# Altium project 17- 0010 ESP32-S3 Control IO.PrjPcb
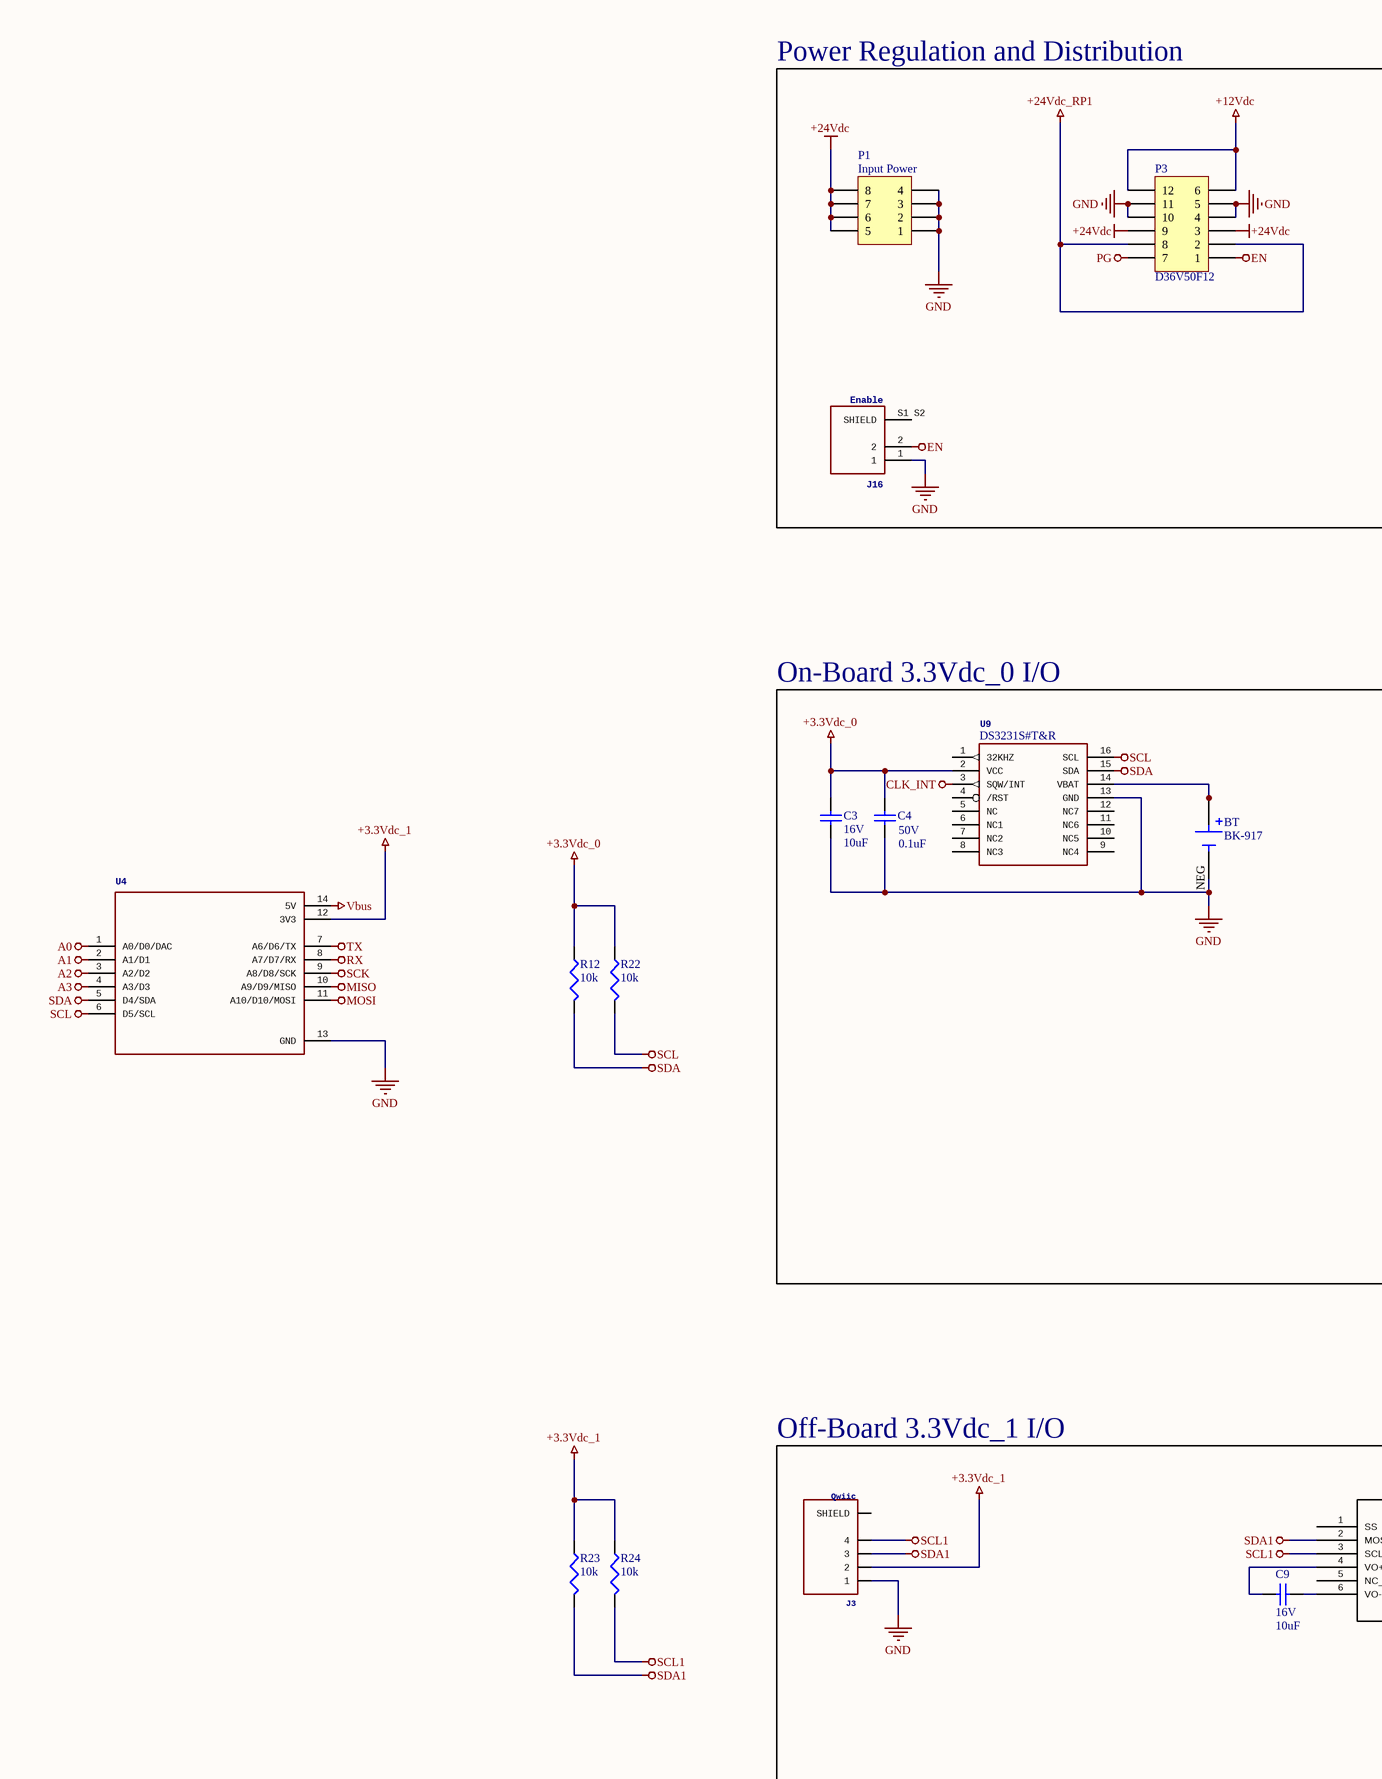
[diagram p0: Sheet1.SchDoc, left]
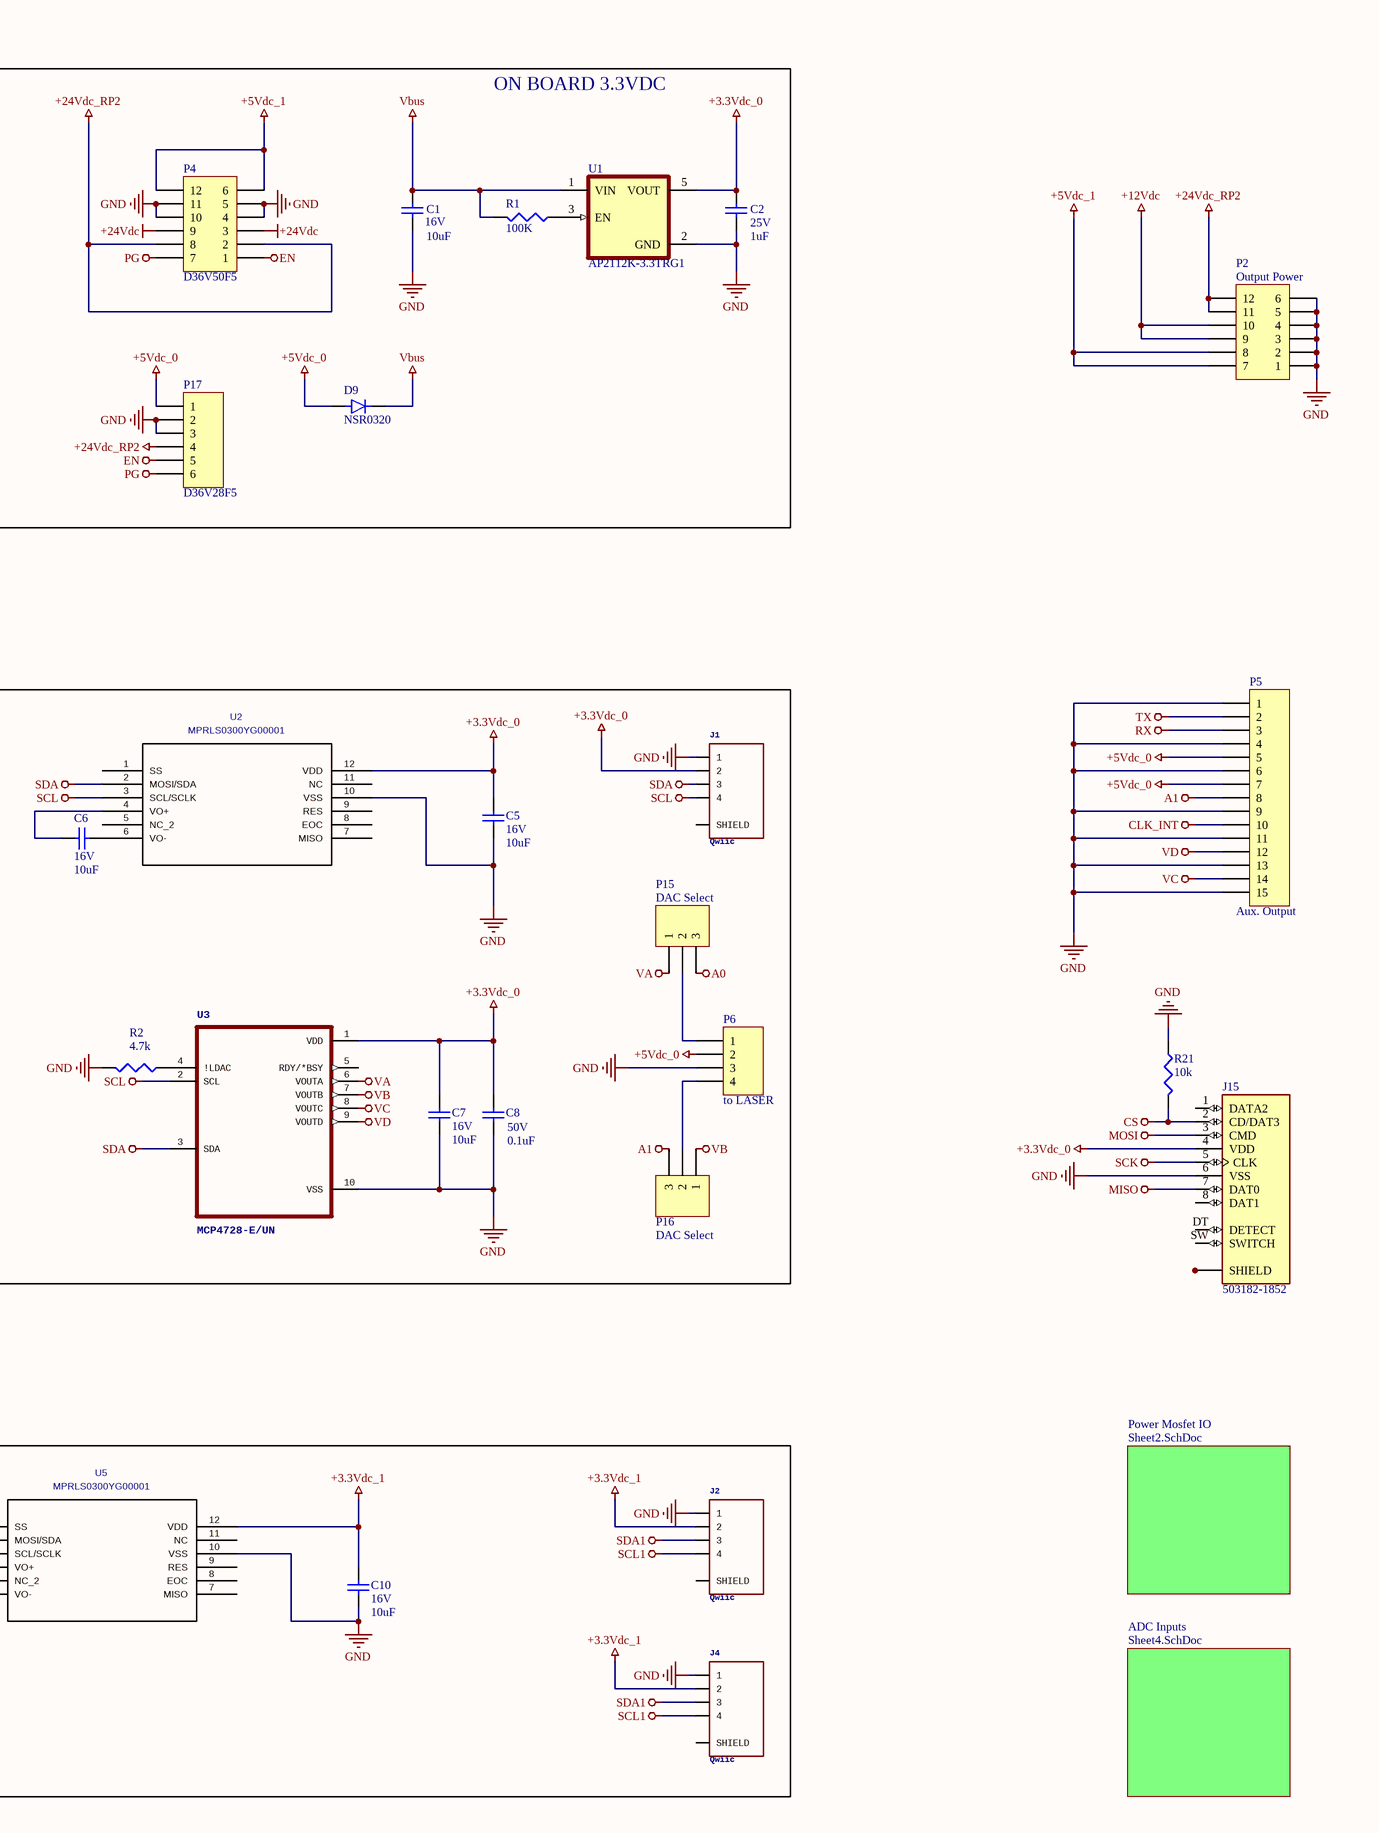
[diagram p1: Sheet1.SchDoc, right]
3 sheets, 100 parts. Net scope: global (net labels, ports and power ports of the same name join across sheets).
Sheets:
  Sheet1.SchDoc
    Power Mosfet IO = Sheet2.SchDoc
    ADC Inputs = Sheet4.SchDoc

## Sheet Sheet1.SchDoc
size A2

### Parts
BT  BK-917  [BAT_BK-917]
C1  16V  value 10uF  [1608[0603]]
C2  25V  value 1uF  [1608[0603]]
C3  16V  value 10uF  [1608[0603]]
C4  50V  value 0.1uF  [1608[0603]]
C5  16V  value 10uF  [1608[0603]]
C6  16V  value 10uF  [1608[0603]]
C7  16V  value 10uF  [1608[0603]]
C8  50V  value 0.1uF  [1608[0603]]
C9  16V  value 10uF  [1608[0603]]
C10  16V  value 10uF  [1608[0603]]
D9  NSR0320  [DIO_MM3Z3V0T1G]
J1  Qwiic  [4P vert]
J2  Qwiic  [4P vert]
J3  Qwiic  [JST_SM04B-SRSS-TB(LF)(SN)]
J4  Qwiic  [JST_SM04B-SRSS-TB(LF)(SN)]
J15  503182-1852  [MOLEX_503182-1852]
J16  Enable  [CONN_BM04B-SRSS-TB(LF)(SN)]
P1  Input Power  [2X4 VERTICAL]
P2  Output Power  [MOLEX_430451214]
P3  D36V50F12  [D36V50FXX, 4.5A]
P4  D36V50F5  [D36V50FXX, 4.5A]
P5  Aux. Output  [15P VERT]
P6  to LASER  [4P Mini-SPOX]
P15  DAC Select  [HDR1X3]
P16  DAC Select  [HDR1X3]
P17  D36V28F5  [D36V28Fx, 3A]
R1  value 100K  [J1-0603]  (hidden comment: Res3)
R2  value 4.7k  [0402]  (hidden comment: Res3)
R12  value 10k  [0402]  (hidden comment: Res3)
R21  value 10k  [0402]  (hidden comment: Res3)
R22  value 10k  [0402]  (hidden comment: Res3)
R23  value 10k  [0402]  (hidden comment: Res3)
R24  value 10k  [0402]  (hidden comment: Res3)
U1  AP2112K-3.3TRG1  [SOT95P285X140-5N]
U2  MPRLS0300YG00001  [MPRLS0300YG00000]
U3  MCP4728-E/UN  [SOP50P490X110-10N]
U4  Check availability  [MODULE_ADAFRUIT_QT_PY]  (value not drawn)
U5  MPRLS0300YG00001  [MPRLS0300YG00000]
U9  DS3231S#T&R  [SO16W]

### Blocks framed on the sheet
Power Regulation and Distribution: C1 C2 D9 J16 P1 P3 P4 P17 R1 U1
On-Board 3.3Vdc_0 I/O: BT C3-C8 J1 P6 P15 P16 R2 U2 U3 U9
Off-Board 3.3Vdc_1 I/O: C9 C10 J2-J4 U5

### Sub-sheets
ADC Inputs = Sheet4.SchDoc: no entries
Power Mosfet IO = Sheet2.SchDoc: no entries

### Nets
+3.3Vdc_0: C2.2 C3.1 C4.1 C5.1 C7.1 C8.1 J1.2 J15.4(VDD) R12.1 R22.1 U1.5(VOUT) U2.12(VDD) U3.1(VDD) U9.2(VCC)
+3.3Vdc_1: C10.1 J2.2 J3.2 J4.2 R23.1 R24.1 U4.12(3V3) U5.12(VDD)
+5Vdc_0: D9.A P5.5 P5.7 P6.2 P17.1
+5Vdc_1: P2.7 P2.8 P4.6 P4.12
+12Vdc: P2.9 P2.10 P3.6 P3.12
+24Vdc: P1.5 P1.6 P1.7 P1.8 P3.3 P3.9 P4.3 P4.9
+24Vdc_RP1: P3.2 P3.8
+24Vdc_RP2: P2.11 P2.12 P4.2 P4.8 P17.4
A0: P15.3 U4.1(A0/D0/DAC)
A1: P5.8 P16.3 U4.2(A1/D1)
A2: U4.3(A2/D2)
A3: U4.4(A3/D3)
CLK_INT: P5.10 U9.3(SQW/INT)
CS: J15.2(CD/DAT3) R21.2
EN: J16.2 P3.1 P4.1 P17.5
GND: BT.NEG C1.1 C2.1 C3.2 C4.2 C5.2 C7.2 C8.2 C10.2 J1.1 J2.1 J3.1 J4.1 J15.6(VSS) J16.1 P1.1 P1.2 P1.3 P1.4 P2.1 P2.2 P2.3 P2.4 P2.5 P2.6 P3.4 P3.5 P3.10 P3.11 P4.4 P4.5 P4.10 P4.11 P5.1 P5.4 P5.6 P5.9 P5.11 P5.13 P5.15 P6.3 P17.2 P17.3 R2.2 R21.1 U1.2(GND) U2.10(VSS) U3.10(VSS) U4.13(GND) U5.10(VSS) U9.13(GND)
MISO: J15.7(DAT0) U4.10(A9/D9/MISO)
MOSI: J15.3(CMD) U4.11(A10/D10/MOSI)
PG: P3.7 P4.7 P17.6
RX: P5.3 U4.8(A7/D7/RX)
SCK: J15.5(CLK) U4.9(A8/D8/SCK)
SCL: J1.4 R22.2 U2.3(SCL/SCLK) U3.2(SCL) U4.6(D5/SCL) U9.16(SCL)
SCL1: J2.4 J3.4 J4.4 R24.2 U5.3(SCL/SCLK)
SDA: J1.3 R12.2 U2.2(MOSI/SDA) U3.3(SDA) U4.5(D4/SDA) U9.15(SDA)
SDA1: J2.3 J3.3 J4.3 R23.2 U5.2(MOSI/SDA)
TX: P5.2 U4.7(A6/D6/TX)
VA: P15.1 U3.6(VOUTA)
VB: P16.1 U3.7(VOUTB)
Vbus: C1.2 D9.C(K) R1.2 U1.1(VIN) U4.14(5V)
VC: P5.14 U3.8(VOUTC)
VD: P5.12 U3.9(VOUTD)
NetBT_1+: BT.1+(POS) BT.2+(POS) BT.3+(POS) BT.4+(POS) U9.14(VBAT)
NetC6_1: C6.1 U2.6(VO-)
NetC6_2: C6.2 U2.4(VO+)
NetC9_1: C9.1 U5.4(VO+)
NetC9_2: C9.2 U5.6(VO-)
NetJ15_P1: J15.P1(SHIELD) J15.P2(SHIELD) J15.P3(SHIELD) J15.P4(SHIELD) J15.P5(SHIELD)
NetP6_1: P6.1 P15.2
NetP6_4: P6.4 P16.2
NetR1_1: R1.1 U1.3(EN)
NetR2_1: R2.1 U3.4(!LDAC)

Not connected (* = marked no-connect by the designer): J1 S1 S2(SHIELD); J2 S1 S2(SHIELD); J3 S1 S2(SHIELD); J4 S1 S2(SHIELD); J15 1(DATA2) 8(DAT1) DT(DETECT) SW(SWITCH); J16 S1 S2(SHIELD); U2 1(SS) 5(NC_2) 7(MISO) 8(EOC) 9(RES) 11(NC); U3 5(RDY/*BSY); U5 1(SS) 5(NC_2) 7(MISO) 8(EOC) 9(RES) 11(NC); U9 1(32KHZ) 4(/RST) 5(NC) 6(NC1) 7(NC2) 8(NC3) 9(NC4) 10(NC5) 11(NC6) 12(NC7)

### Notes on the sheet
- ON BOARD 3.3VDC
- Title
- Size:
- Date:
- File:
- A2
- Number:
- Time:
- Revision:
- Sheet
- of

### Library data of the parts
BT = BK-917: BATTERY RETAINER COIN PC PIN; Manufacturer: MPD; Manufacturer Part #: BK-917
C1 C3 C5-C7 C9 C10 = Cap Semi: CAP CER 10UF 16V X5R 0603; Manufacturer Part #: CC0603KRX5R7BB106; Manufacturer: YAGEO; Footprints: 0603
C2 = Cap Semi: CAP CER 1UF 25V X7R 0603; Manufacturer Part #: AC0603KRX7R8BB105; Manufacturer: YAGEO; Footprints: 0603
C4 C8 = Cap Semi: CAP CER 0.1UF 50V X7R 0603; Manufacturer Part #: CC0603KPX7R9BB104; Manufacturer: YAGEO; Footprints: 0603
D9 = S1M: DIODE SCHOTTKY 20V 1A SOD323; Manufacturer Part #: NSR0320MW2T1G; Manufacturer: onsemi; Footprint: SOD-323
J1 J2 = SM04B-SRSS-TB(LF)(SN): Manufacturer Part #: BM04B-SRSS-TB(LF)(SN); Manufacturer: JST Sales
J3 J4 = SM04B-SRSS-TB(LF)(SN): Manufacturer: JST Sales; Manufacturer Part #: SM04B-SRSS-TB(LF)(SN)
J15 = 503182-1852: 10 (8 + 2) Position Card Connector Secure Digital - microSDâ„¢ Surface Mount, Right Angle Gold; Manufacturer: Molex; Manufacturer Part #: 5031821852
J16 = BM04B-SRSS-TB(LF)(SN): Manufacturer: JST Sales; Manufacturer Part #: BM04B-SRSS-TB(LF)(SN)
P1 = Header 4X2A: CONN HEADER VERT 8POS 3MM; Manufacturer Part #: 0430450827; Manufacturer: Molex; Do Not Install: *; Vendor: *; Vendor Part Number: *
P2 = Header 6X2A: CONN HEADER VERT 12POS 3MM; Manufacturer Part #: 0430451227; Manufacturer: Molex
P3 = Header 6X2A: DC DC CONVERTER 12V 54W; Vendor Part Number: 2183-4095-ND; Manufacturer: Pololu; Vendor: digikey; Manufacturer Part #: D36V50F12; Do Not Install: *
P4 = Header 6X2A: 12V, 4.5A Step-Down Voltage Regulator5V, 5.5A Step-Down Voltage Regulator; Vendor: Pololu; Manufacturer Part #: D36V50F5; Do Not Install: *; Vendor Part Number: D36V50F5; Manufacturer: Pololu
P5 = Header 15: Header, 15-Pin; Manufacturer Part #: BM15B-SRSS-TB(LF)(SN); Manufacturer: JST Sales America Inc.
P6 = Header 4: Connector Header Through Hole, Right Angle 4 position 0.098" (2.50mm); Manufacturer Part #: 0022057045; Manufacturer: Molex
P15 P16 = Header 3: Header, 3-Pin; Manufacturer Part #: 68000-103HLF; Manufacturer: Amphenol ICC (FCI)
P17 = Header 6: 5V, 3.2A Step-Down Voltage Regulator; Vendor: Pololu; Manufacturer Part #: D36V28F5; Vendor Part Number: D36V28F5; Manufacturer: Pololu
R1 = Res3: RES 100K OHM 1% 1/4W 0603; Manufacturer Part #: SR0603FR-7T100KL; Manufacturer: YAGEO; Footprints: 0603
R2 = Res3: RES 4.7K OHM 1% 1/5W 0402; Manufacturer Part #: SR0402FR-7T4K7L; Manufacturer: YAGEO; Footprints: 0402
R12 R21-R24 = Res3: RES 10 KOHM 1% 1/8W 0402; Manufacturer Part #: AC0402FR-7W10KL; Manufacturer: YAGEO; Footprints: 0402
U1 = AP2112K-3.3TRG1: IC REG LINEAR 3.3V 600MA SOT25; Manufacturer: Diodes Incorporated; Manufacturer Part #: AP2112K-3.3TRG1; Footprint: SOT-25
U2 U5 = MPRLS0300YG00001: Manufacturer: Honeywell; Manufacturer Part #: MPRLS0300YG00001B
U3 = MCP4728-E/UN: Manufacturer: Microchip; Manufacturer Part #: MCP4728-E/UN
U4 = ADAFRUIT_QT_PY: WiFi Dev Board with STEMMA QT - 8 MB Flash / No PSRAM; Manufacturer Part #: QT PY ESP32-S3; Vendor Part Number: 5426; Do Not Install: DNI; Vendor: Adafruit
U9 = DS3231/SO: Real-Time Clock; Manufacturer: Maxim; Manufacturer Part #: DS3231S#T&R

## Sheet Sheet2.SchDoc
size A3
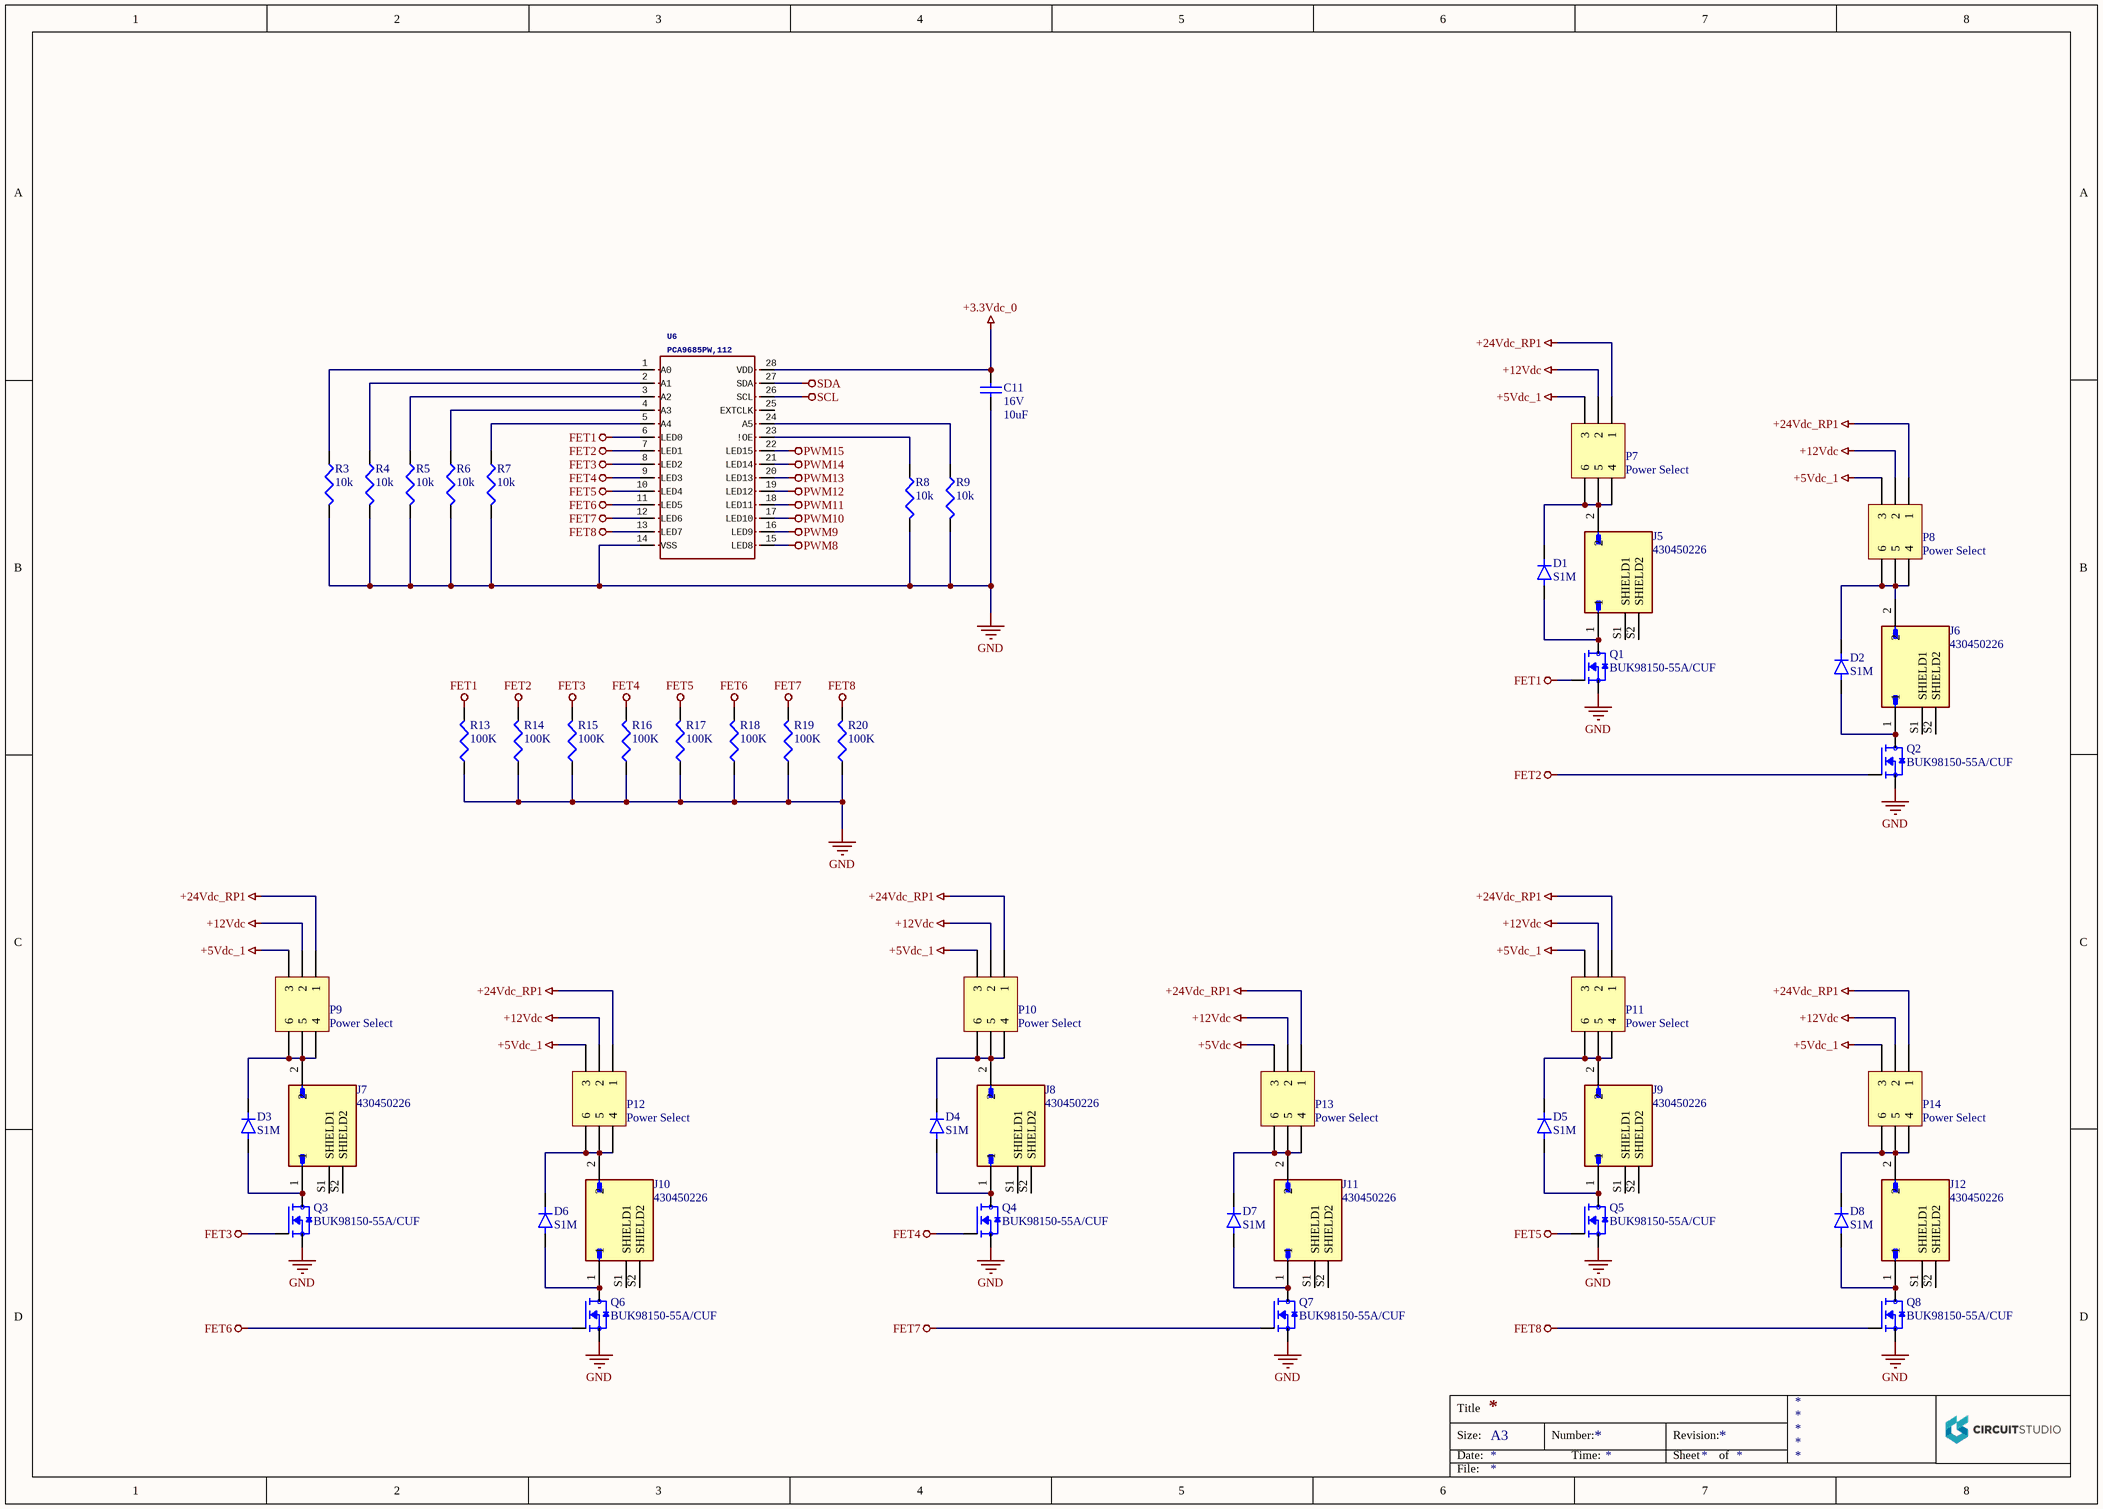
[diagram p2: Sheet2.SchDoc]

### Parts
C11  16V  value 10uF  [1608[0603]]
D1  S1M  [DIOM4325X250N]
D2  S1M  [DIOM4325X250N]
D3  S1M  [DIOM4325X250N]
D4  S1M  [DIOM4325X250N]
D5  S1M  [DIOM4325X250N]
D6  S1M  [DIOM4325X250N]
D7  S1M  [DIOM4325X250N]
D8  S1M  [DIOM4325X250N]
J5  430450226  [MOLEX_430450226]
J6  430450226  [MOLEX_430450226]
J7  430450226  [MOLEX_430450226]
J8  430450226  [MOLEX_430450226]
J9  430450226  [MOLEX_430450226]
J10  430450226  [MOLEX_430450226]
J11  430450226  [MOLEX_430450226]
J12  430450226  [MOLEX_430450226]
P7  Power Select  [HDR2X3_CEN]
P8  Power Select  [HDR2X3_CEN]
P9  Power Select  [HDR2X3_CEN]
P10  Power Select  [HDR2X3_CEN]
P11  Power Select  [HDR2X3_CEN]
P12  Power Select  [HDR2X3_CEN]
P13  Power Select  [HDR2X3_CEN]
P14  Power Select  [HDR2X3_CEN]
Q1  BUK98150-55A/CUF  [SOT230P700X180-4N]
Q2  BUK98150-55A/CUF  [SOT230P700X180-4N]
Q3  BUK98150-55A/CUF  [SOT230P700X180-4N]
Q4  BUK98150-55A/CUF  [SOT230P700X180-4N]
Q5  BUK98150-55A/CUF  [SOT230P700X180-4N]
Q6  BUK98150-55A/CUF  [SOT230P700X180-4N]
Q7  BUK98150-55A/CUF  [SOT230P700X180-4N]
Q8  BUK98150-55A/CUF  [SOT230P700X180-4N]
R3  value 10k  [0402]  (hidden comment: Res3)
R4  value 10k  [0402]  (hidden comment: Res3)
R5  value 10k  [0402]  (hidden comment: Res3)
R6  value 10k  [0402]  (hidden comment: Res3)
R7  value 10k  [0402]  (hidden comment: Res3)
R8  value 10k  [0402]  (hidden comment: Res3)
R9  value 10k  [0402]  (hidden comment: Res3)
R13  value 100K  [J1-0603]  (hidden comment: Res3)
R14  value 100K  [J1-0603]  (hidden comment: Res3)
R15  value 100K  [J1-0603]  (hidden comment: Res3)
R16  value 100K  [J1-0603]  (hidden comment: Res3)
R17  value 100K  [J1-0603]  (hidden comment: Res3)
R18  value 100K  [J1-0603]  (hidden comment: Res3)
R19  value 100K  [J1-0603]  (hidden comment: Res3)
R20  value 100K  [J1-0603]  (hidden comment: Res3)
U6  PCA9685PW,112  [TSSOP28-0.65-9.7X4.4MM]

### Nets
+3.3Vdc_0: C11.1 U6.28(VDD)
+5Vdc: P13.3
+5Vdc_1: P7.3 P8.3 P9.3 P10.3 P11.3 P12.3 P14.3
+12Vdc: P7.2 P8.2 P9.2 P10.2 P11.2 P12.2 P13.2 P14.2
+24Vdc_RP1: P7.1 P8.1 P9.1 P10.1 P11.1 P12.1 P13.1 P14.1
FET1: Q1.1(G) R13.2 U6.6(LED0)
FET2: Q2.1(G) R14.2 U6.7(LED1)
FET3: Q3.1(G) R15.2 U6.8(LED2)
FET4: Q4.1(G) R16.2 U6.9(LED3)
FET5: Q5.1(G) R17.2 U6.10(LED4)
FET6: Q6.1(G) R18.2 U6.11(LED5)
FET7: Q7.1(G) R19.2 U6.12(LED6)
FET8: Q8.1(G) R20.2 U6.13(LED7)
GND: C11.2 Q1.3(S) Q2.3(S) Q3.3(S) Q4.3(S) Q5.3(S) Q6.3(S) Q7.3(S) Q8.3(S) R3.2 R4.2 R5.2 R6.2 R7.2 R8.2 R9.2 R13.1 R14.1 R15.1 R16.1 R17.1 R18.1 R19.1 R20.1 U6.14(VSS)
PWM8: U6.15(LED8)
PWM9: U6.16(LED9)
PWM10: U6.17(LED10)
PWM11: U6.18(LED11)
PWM12: U6.19(LED12)
PWM13: U6.20(LED13)
PWM14: U6.21(LED14)
PWM15: U6.22(LED15)
SCL: U6.26(SCL)
SDA: U6.27(SDA)
NetD1_A: D1.A J5.1 Q1.2(D) Q1.4(D)
NetD1_C: D1.C(K) J5.2 P7.4 P7.5 P7.6
NetD2_A: D2.A J6.1 Q2.2(D) Q2.4(D)
NetD2_C: D2.C(K) J6.2 P8.4 P8.5 P8.6
NetD3_A: D3.A J7.1 Q3.2(D) Q3.4(D)
NetD3_C: D3.C(K) J7.2 P9.4 P9.5 P9.6
NetD4_A: D4.A J8.1 Q4.2(D) Q4.4(D)
NetD4_C: D4.C(K) J8.2 P10.4 P10.5 P10.6
NetD5_A: D5.A J9.1 Q5.2(D) Q5.4(D)
NetD5_C: D5.C(K) J9.2 P11.4 P11.5 P11.6
NetD6_A: D6.A J10.1 Q6.2(D) Q6.4(D)
NetD6_C: D6.C(K) J10.2 P12.4 P12.5 P12.6
NetD7_A: D7.A J11.1 Q7.2(D) Q7.4(D)
NetD7_C: D7.C(K) J11.2 P13.4 P13.5 P13.6
NetD8_A: D8.A J12.1 Q8.2(D) Q8.4(D)
NetD8_C: D8.C(K) J12.2 P14.4 P14.5 P14.6
NetR3_1: R3.1 U6.1(A0)
NetR4_1: R4.1 U6.2(A1)
NetR5_1: R5.1 U6.3(A2)
NetR6_1: R6.1 U6.4(A3)
NetR7_1: R7.1 U6.5(A4)
NetR8_1: R8.1 U6.23(!OE)
NetR9_1: R9.1 U6.24(A5)

Not connected (* = marked no-connect by the designer): J5 S1(SHIELD1) S2(SHIELD2); J6 S1(SHIELD1) S2(SHIELD2); J7 S1(SHIELD1) S2(SHIELD2); J8 S1(SHIELD1) S2(SHIELD2); J9 S1(SHIELD1) S2(SHIELD2); J10 S1(SHIELD1) S2(SHIELD2); J11 S1(SHIELD1) S2(SHIELD2); J12 S1(SHIELD1) S2(SHIELD2); U6 25(EXTCLK)

### Notes on the sheet
- Title
- Size:
- Date:
- A3
- Number:
- Time:
- Revision:
- Sheet
- of
- File:

### Library data of the parts
C11 = Cap Semi: as C1 on sheet Sheet1; Footprints: 0603
D1-D8 = S1M: DIODE GEN PURP 1KV 1A SMA; Manufacturer Part #: S1MLHRVG; Manufacturer: Taiwan Semiconductor
J5-J12 = 430450226: CONN HEADER VERT 2POS; Manufacturer Part #: 0430450226; Manfacturer: Molex; Do Not Install: *; Vendor: *; Vendor Part Number: *
P7-P14 = Header 3X2A: Header, 3-Pin, Dual row; Manufacturer Part #: 67997-206HLF; Manufacturer: Amphenol ICC (FCI)
Q1-Q8 = BUK98150-55A/CUF: N-MOSFET N-CH 55V 5.5A SOT223; Manufacturer: Nexperia USA; Manufacturer Part #: BUK98150-55A/CUF; Footprint: SOT223
R3-R9 = Res3: as R12 on sheet Sheet1; Footprints: 0402
R13-R20 = Res3: as R1 on sheet Sheet1; Footprints: 0603
U6 = DRIVER-PCA9685PW(TSSOP28): Manufacturer: NXP USA; Manufacturer Part #: PCA9685PW,112

## Sheet Sheet4.SchDoc
size A3
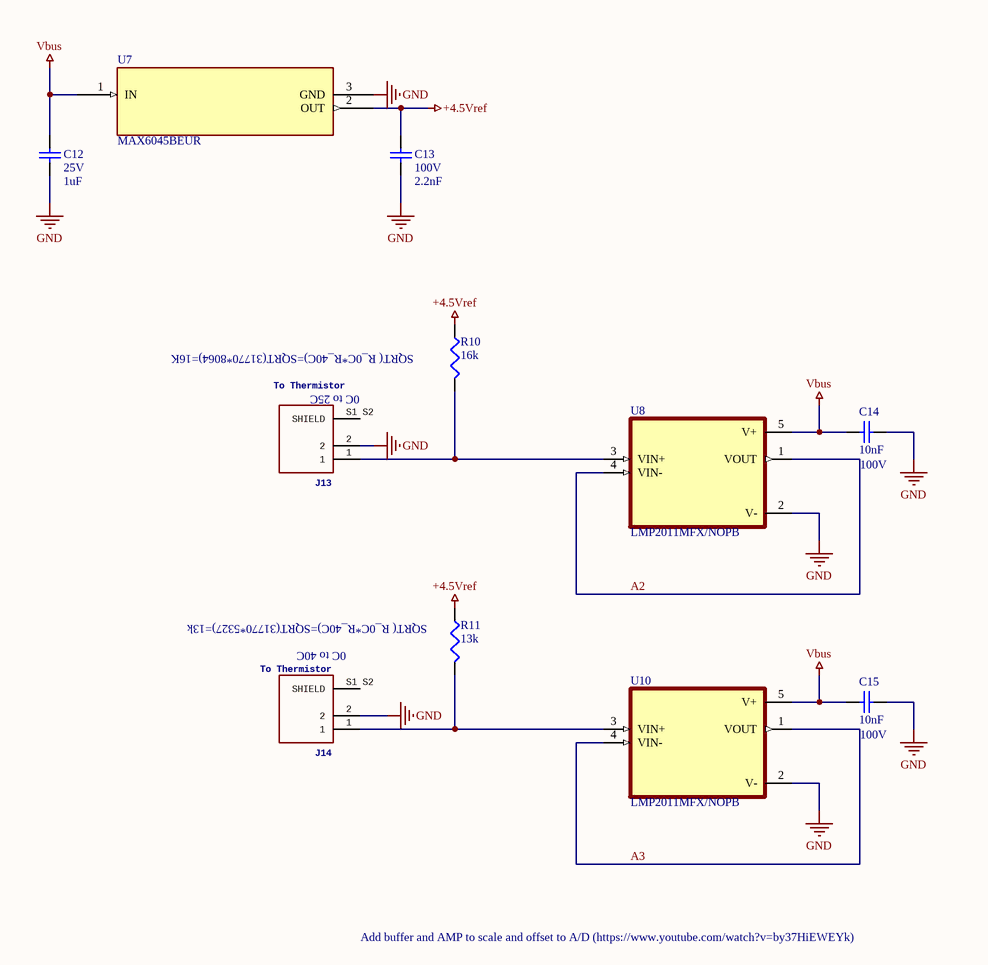
[diagram p3: Sheet4.SchDoc]

### Parts
C12  25V  value 1uF  [1608[0603]]
C13  100V  value 2.2nF  [1608[0603]]
C14  100V  value 10nF  [1608[0603]]
C15  100V  value 10nF  [1608[0603]]
J13  To Thermistor  [CONN_BM04B-SRSS-TB(LF)(SN)]
J14  To Thermistor  [CONN_BM04B-SRSS-TB(LF)(SN)]
R10  value 16k  [J1-0603]  (hidden comment: Res3)
R11  value 13k  [J1-0603]  (hidden comment: SQRT( R_0C*R_40C))
U7  MAX6045BEUR  [21-0051H]
U8  LMP2011MFX/NOPB  [SOT95P280X145-5N]
U10  LMP2011MFX/NOPB

### Nets
+4.5Vref: C13.2 R10.1 R11.1 U7.2(OUT)
A2: U8.1(VOUT) U8.4(VIN-)
A3: U10.1(VOUT) U10.4(VIN-)
GND: C12.1 C13.1 C14.1 C15.1 J13.2 J14.2 U7.3(GND) U8.2(V-) U10.2(V-)
Vbus: C12.2 C14.2 C15.2 U7.1(IN) U8.5(V+) U10.5(V+)
NetJ13_1: J13.1 R10.2 U8.3(VIN+)
NetJ14_1: J14.1 R11.2 U10.3(VIN+)

Not connected (* = marked no-connect by the designer): J13 S1 S2(SHIELD); J14 S1 S2(SHIELD)

### Notes on the sheet
- SQRT( R_0C*R_40C)=SQRT(31770*8064)=16K
- (near J13) 0C to 25C
- (near R11) SQRT( R_0C*R_40C)=SQRT(31770*5327)=13k
- (near J14) 0C to 40C
- Add buffer and AMP to scale and offset to A/D (https://www.youtube.com/watch?v=by37HiEWEYk)
- Title
- Size:
- Date:
- A3
- Number:
- Time:
- Revision:
- Sheet
- of
- File:

### Library data of the parts
C12 = Cap Semi: as C2 on sheet Sheet1; Footprints: 0603
C13 = Cap Semi: CAP CER 2200PF 100V X7R 0603; Manufacturer Part #: CC0603KRX7R0BB222; Manufacturer: YAGEO; Footprints: 0603
C14 C15 = Cap Semi: CAP CER 10000PF 100V X7R 0603; Manufacturer: YAGEO; Manufacturer Part #: CC0603KRX7R0BB103; Footprints: 0603
J13 J14 = BM04B-SRSS-TB(LF)(SN): Manufacturer: JST Sales; Manufacturer Part #: BM04B-SRSS-TB(LF)(SN)
R10 = Res3: Resistor, 0.1%, 1/10W; Manufacturer Part #: ERA-3AEB163V; Manufacturer: Panasonic Electronic Components; Footprints: 0603
R11 = Res3: Resistor, 0.1%, 1/5W; Manufacturer Part #: ERJ-PB3B1302V; Manufacturer: Panasonic Electronic Components; Footprints: 0603
U7 = MAX6045AEUR: Voltage References Precision, Low-Power, Low-Dropout, SOT23-3 Voltage References; Manufacturer: Analog Devices Inc./Maxim Integrated; Manufacturer Part #: MAX6045BEUR
U8 U10 = LMP2011MFX/NOPB: Single, High Precision, Rail-to-Rail Output Operational Amplifier; Manufacturer: Texas Instruments; Manufacturer Part #: LMP2011MFX/NOPB

## Nets that join several sheets
+3.3Vdc_0: Sheet1 (14 pins), Sheet2 (C11.1 U6.28)
+5Vdc_1: Sheet1 (P2.7 P2.8 P4.6 P4.12), Sheet2 (7 pins)
+12Vdc: Sheet1 (P2.9 P2.10 P3.6 P3.12), Sheet2 (8 pins)
+24Vdc_RP1: Sheet1 (P3.2 P3.8), Sheet2 (8 pins)
A2: Sheet1 (U4.3), Sheet4 (U8.1 U8.4)
A3: Sheet1 (U4.4), Sheet4 (U10.1 U10.4)
GND: Sheet1 (51 pins), Sheet2 (25 pins), Sheet4 (9 pins)
SCL: Sheet1 (6 pins), Sheet2 (U6.26)
SDA: Sheet1 (6 pins), Sheet2 (U6.27)
Vbus: Sheet1 (5 pins), Sheet4 (6 pins)